# EAGLE design usb_keyboard (EAGLE 7.2.0)
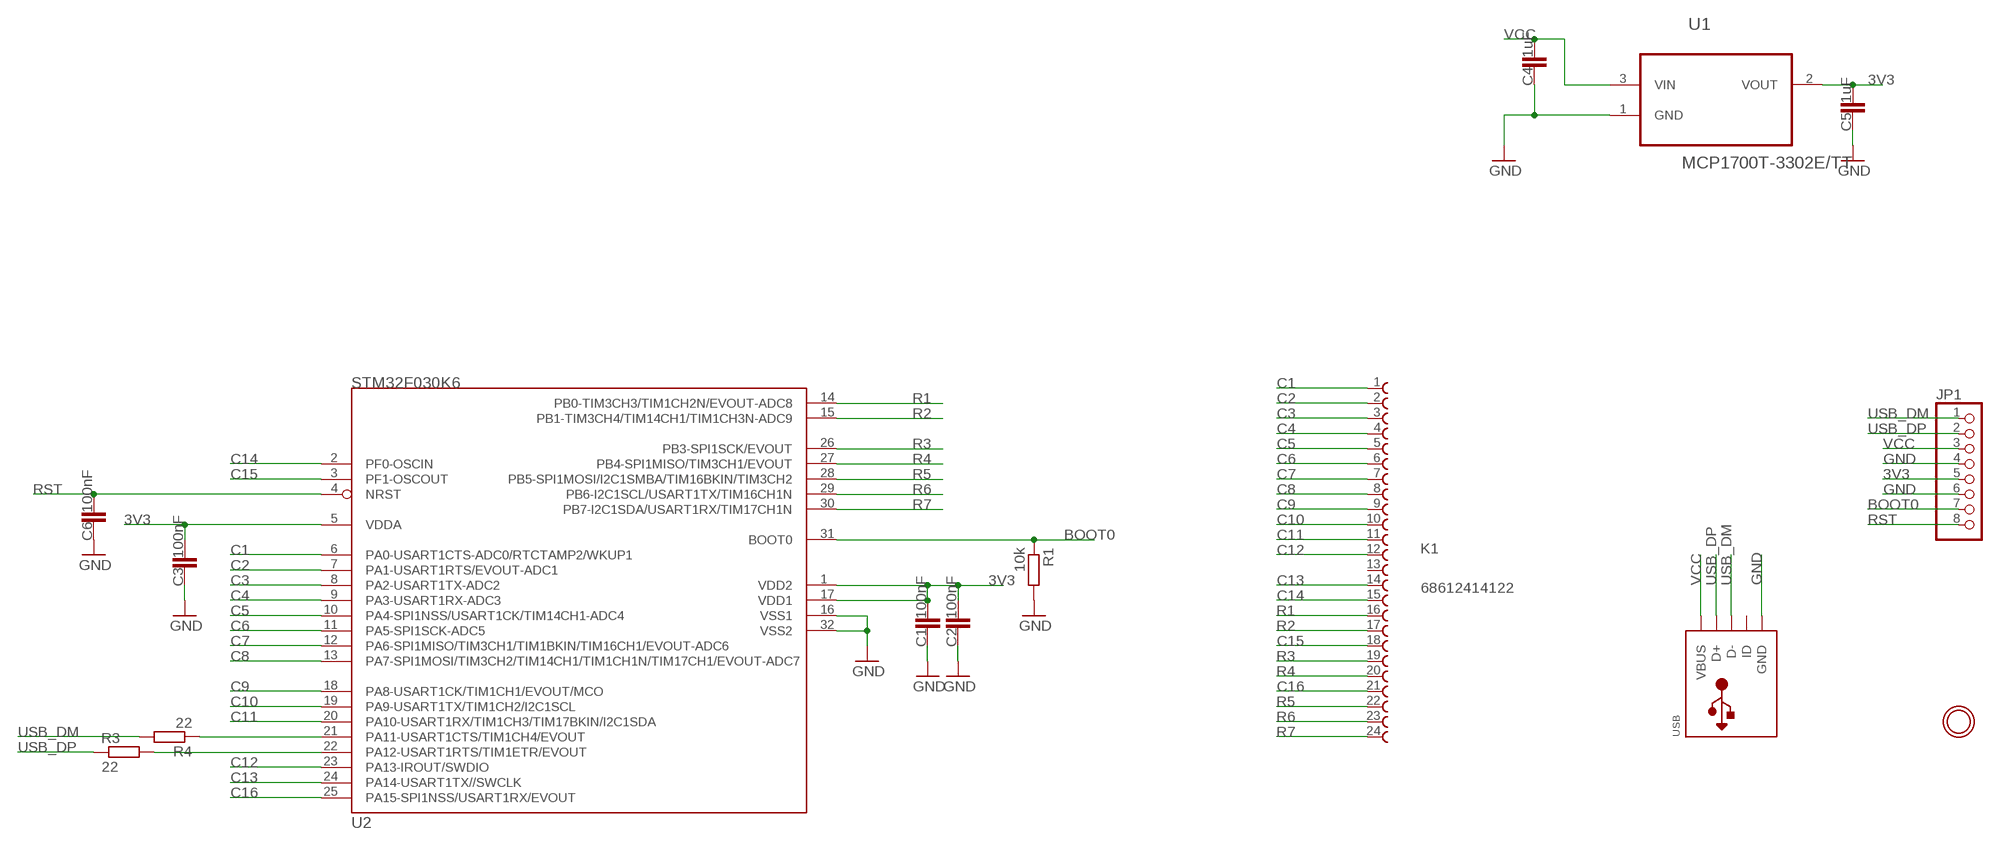
[diagram p0: schematic, sheet 1]

## Parts
C1  100nF  C-EUC0603K  [C0603K]
C2  100nF  C-EUC0603K  [C0603K]
C3  100nF  C-EUC0603K  [C0603K]
C4  1uF  C-EUC0603K  [C0603K]
C5  1uF  C-EUC0603K  [C0603K]
C6  100nF  C-EUC0603K  [C0603K]
JP1  HEADER-1X8ROUND  [1X08_ROUND]
K1  68612414122  [68612414122]
R1  10k  R-EU_R0603  [R0603]
R3  22  R-EU_R0603  [R0603]
R4  22  R-EU_R0603  [R0603]
U1  MCP1700T-3302E/TT  [SOT95P237X112-3N]
U2  STM32F030K6  [LQFP32]
U$2  MOUNTINGHOLE2.0  [MOUNTINGHOLE_2.0_PLATED]
USB  USBMOLEX  [USB-MINIB-THM-MOLEX]

## Nets
3V3: C1.2 C2.2 C3.2 C5.2 JP1.5 U1.2(VOUT) U2.1(VDD2) U2.5(VDDA) U2.17(VDD1)
BOOT0: JP1.7 R1.1 U2.31(BOOT0)
C1: K1.1 U2.6(PA0-USART1CTS-ADC0/RTCTAMP2/WKUP1)
C2: K1.2 U2.7(PA1-USART1RTS/EVOUT-ADC1)
C3: K1.3 U2.8(PA2-USART1TX-ADC2)
C4: K1.4 U2.9(PA3-USART1RX-ADC3)
C5: K1.5 U2.10(PA4-SPI1NSS/USART1CK/TIM14CH1-ADC4)
C6: K1.6 U2.11(PA5-SPI1SCK-ADC5)
C7: K1.7 U2.12(PA6-SPI1MISO/TIM3CH1/TIM1BKIN/TIM16CH1/EVOUT-ADC6)
C8: K1.8 U2.13(PA7-SPI1MOSI/TIM3CH2/TIM14CH1/TIM1CH1N/TIM17CH1/EVOUT-ADC7)
C9: K1.9 U2.18(PA8-USART1CK/TIM1CH1/EVOUT/MCO)
C10: K1.10 U2.19(PA9-USART1TX/TIM1CH2/I2C1SCL)
C11: K1.11 U2.20(PA10-USART1RX/TIM1CH3/TIM17BKIN/I2C1SDA)
C12: K1.12 U2.23(PA13-IROUT/SWDIO)
C13: K1.14 U2.24(PA14-USART1TX//SWCLK)
C14: K1.15 U2.2(PF0-OSCIN)
C15: K1.18 U2.3(PF1-OSCOUT)
C16: K1.21 U2.25(PA15-SPI1NSS/USART1RX/EVOUT)
GND: C1.1 C2.1 C3.1 C4.1 C5.1 C6.1 JP1.4 JP1.6 R1.2 U1.1(GND) U2.16(VSS1) U2.32(VSS2) USB.GND
N$1: R4.1 U2.21(PA11-USART1CTS/TIM1CH4/EVOUT)
N$2: R3.2 U2.22(PA12-USART1RTS/TIM1ETR/EVOUT)
R1: K1.16 U2.14(PB0-TIM3CH3/TIM1CH2N/EVOUT-ADC8)
R2: K1.17 U2.15(PB1-TIM3CH4/TIM14CH1/TIM1CH3N-ADC9)
R3: K1.19 U2.26(PB3-SPI1SCK/EVOUT)
R4: K1.20 U2.27(PB4-SPI1MISO/TIM3CH1/EVOUT)
R5: K1.22 U2.28(PB5-SPI1MOSI/I2C1SMBA/TIM16BKIN/TIM3CH2)
R6: K1.23 U2.29(PB6-I2C1SCL/USART1TX/TIM16CH1N)
R7: K1.24 U2.30(PB7-I2C1SDA/USART1RX/TIM17CH1N)
RST: C6.2 JP1.8 U2.4(NRST)
USB_DM: JP1.1 R4.2 USB.D-
USB_DP: JP1.2 R3.1 USB.D+
VCC: C4.2 JP1.3 U1.3(VIN) USB.VBUS
Unconnected: K1.13 USB.ID

## Library data of the parts
C1-C6 = rcl:C-EU: CAPACITOR, European symbol
JP1 = microbuilder:HEADER-1X8: PIN HEADER
K1 = FPC_Connectors_Flat_Flexible_Cable_rev15c:68612414122: WR-FPC 1.00mm SMT ZIF Horizontal Top Contact, 24 Pins=>Code : Con_FPC_ZIF_1.00_68612414122 <http://katalog.we-online.de/media/images/eican/Con_FPC_ZIF_1.00_6861xx14122_pf2.jpg> Details see: http://katalog.we-online.de/en/em/686_1xx_141_22 Created 2014-07-09, Karrer Zheng 2014 (C) Würth Elektronik
R1 R3 R4 = rcl:R-EU_: RESISTOR, European symbol
U1 = Microchip_By_element14_Batch_1:MCP1700T-3302E/TT: Low Quiescent Current LDO; MPN: MCP1700T-3302E/TT; OC_FARNELL: 1296592; OC_NEWARK: 88H9817; PACKAGE: SOT23-3; SUPPLIER: Microchip
U2 = pel_stm32:STM32F030K6
U$2 = microbuilder:MOUNTINGHOLE: Mounting Hole For #2 screws (0.086"/2.18mm width, 0.094"/2.4mm hole) use 2.5mm
USB = adafruit:USB: USB Connectors USBMINIB - Surface Mount Female Mini-B USB Connector 4UConnector: 06564 By microbuilder.eu Thru-hole RA Female Mini-B USB Connector 4UConnector: 18732 By ladyada.net

## Board
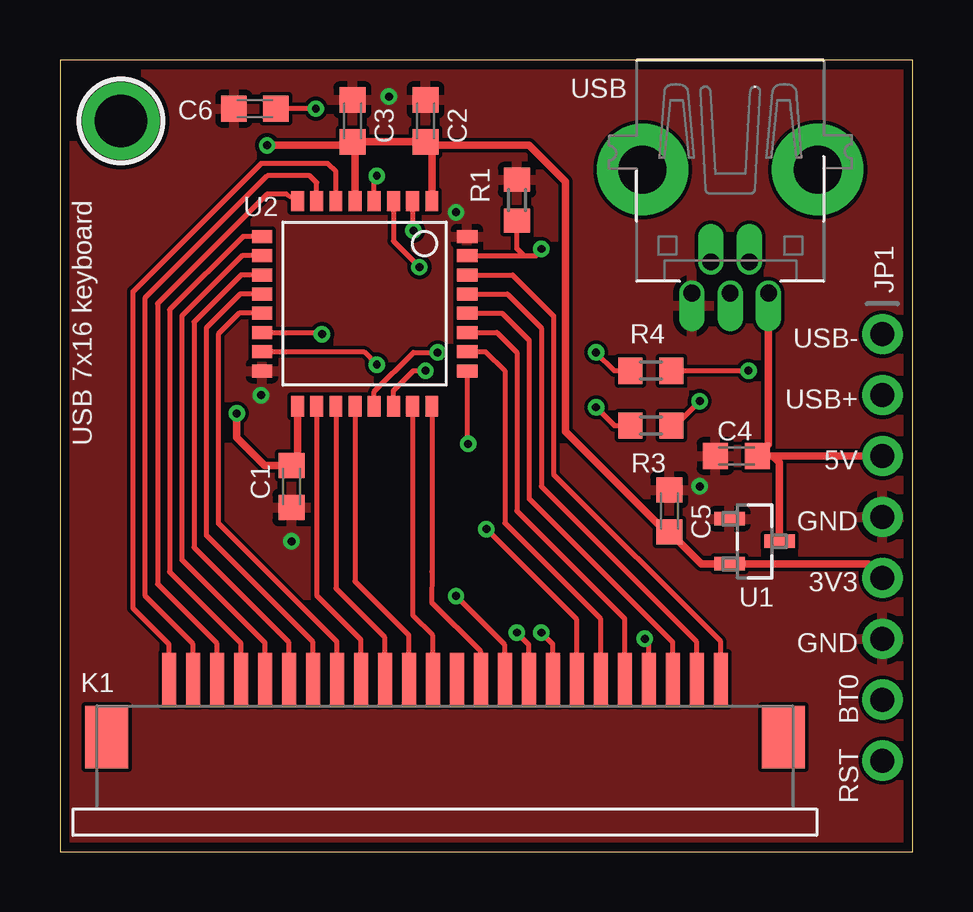
[diagram p1: board, top side]
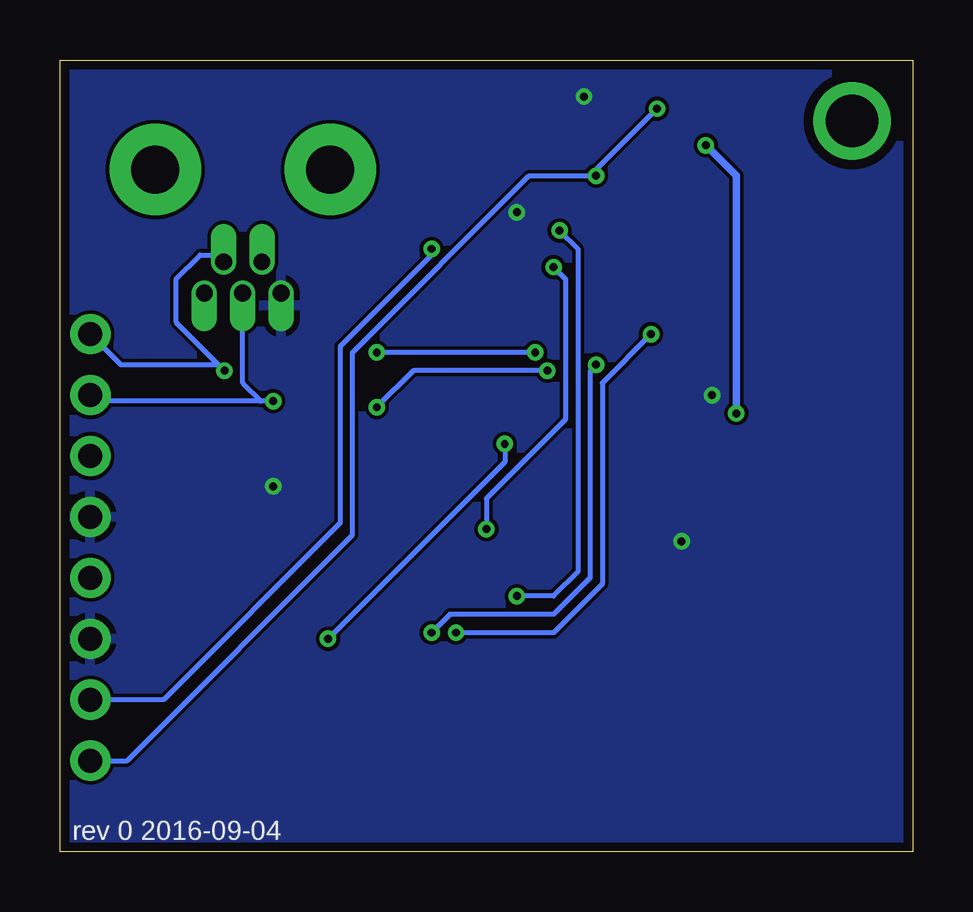
[diagram p2: board, bottom side, seen from below]

Size 35.56 x 33.02 mm. Coordinates in mm from the lower left corner, seen from the top.
Outline: 0,0 35.56,0 35.56,33.02 0,33.02 0,0
Copper layers (1*16): Top 0.0356mm / dielectric 1.5011mm / Bottom 0.0356mm
Design rules "LaenPCBOrder": minimum track width 6mil, minimum drill 13mil, track to track 6mil, track to pad 6mil, pad to pad 6mil, via to via 6mil, smd to smd 6mil, copper to edge 15mil, drill to drill 6mil, minimum pad ring 7mil, minimum via ring 7mil, stop-mask expansion 3mil, vias tented up to drill 0mil, thermal gap 10mil

### Footprints (pad centres in the part's own frame; a part is rotated, then mirrored left to right if it is on the bottom)
C0603K = smd 1.05 x 1.08: 1 -0.875,0; 2 0.875,0
1X08_ROUND = drill 1 pad 1.676: 1 -8.89,0; 2 -6.35,0; 3 -3.81,0; 4 -1.27,0; 5 1.27,0; 6 3.81,0; 7 6.35,0; 8 8.89,0
68612414122 = smd 0.6 x 2.2: 1 -10.69,1.1; 2 -9.69,1.1; 3 -8.69,1.1; 4 -7.69,1.1; 5 -6.69,1.1; 6 -5.69,1.1; 7 -4.69,1.1; 8 -3.69,1.1; 9 -2.69,1.1; 10 -1.69,1.1; 11 -0.69,1.1; 12 0.31,1.1; 13 1.31,1.1; 14 2.31,1.1; 15 3.31,1.1; 16 4.31,1.1; 17 5.31,1.1; 18 6.31,1.1; 19 7.31,1.1; 20 8.31,1.1; 21 9.31,1.1; 22 10.31,1.1; 23 11.31,1.1; 24 12.31,1.1 | smd 1.8 x 2.6: Z1 -13.29,-1.3; Z2 14.91,-1.3
R0603 = smd 1 x 1.1: 1 -0.85,0; 2 0.85,0
SOT95P237X112-3N = smd 0.559 x 1.27: 1 -0.94,-1.041; 2 0.94,-1.041; 3 0,1.041
LQFP32 = smd 0.54 x 0.85: 1 -2.8,-4.275; 2 -2,-4.275; 3 -1.2,-4.275; 4 -0.4,-4.275; 5 0.4,-4.275; 6 1.2,-4.275; 7 2,-4.275; 8 2.8,-4.275; 17 2.8,4.275; 18 2,4.275; 19 1.2,4.275; 20 0.4,4.275; 21 -0.4,4.275; 22 -1.2,4.275; 23 -2,4.275; 24 -2.8,4.275 | smd 0.85 x 0.54: 9 4.275,-2.8; 10 4.275,-2; 11 4.275,-1.2; 12 4.275,-0.4; 13 4.275,0.4; 14 4.275,1.2; 15 4.275,2; 16 4.275,2.8; 25 -4.275,2.8; 26 -4.275,2; 27 -4.275,1.2; 28 -4.275,0.4; 29 -4.275,-0.4; 30 -4.275,-1.2; 31 -4.275,-2; 32 -4.275,-2.8
MOUNTINGHOLE_2.0_PLATED = drill 2.2 pad 3: P$1 0,0
USB-MINIB-THM-MOLEX = drill 0.7 offset: D+ 0,9.72; D- -0.8,8.42; GND 1.6,9.72; ID 0.8,8.42; VBUS -1.6,9.72 | drill 2 pad 3.81: GND1 -3.65,4.57; GND4 3.65,4.57

### Placement (x,y rotation side)
C1  9.65,15.24 90 top
C2  15.24,30.48 270 top
C3  12.19,30.48 270 top
C4  28.19,16.51 0 top
C5  25.4,14.22 270 top
C6  8.13,30.99 0 top
JP1  34.29,12.7 270 top
K1  15.24,6.1 0 top
R1  19.05,27.18 90 top
R3  24.64,17.78 180 top
R4  24.64,20.07 0 top
U1  28.96,12.95 270 top
U2  12.7,22.86 180 top
U$2  2.54,30.48 0 top
USB  27.94,33.02 180 top

### Tracks (layer width: path | path; a pad name or v marks a point on that pad's centre or on a via)
3V3  (via drill 0.33)
  Top 0.305: 9.54,16.26 C1.2 | C1.2 8.52,16.11 7.37,17.27 v7.37,18.29 | v8.64,29.46 12.05,29.46 | U2.5 12.3,29.2 12.05,29.46 | 12.05,29.46 C3.2 C2.2 15.38,29.46 | U2.1 15.5,29.34 15.38,29.46 | U2.17 9.9,16.38 C1.2 | 15.38,29.46 19.56,29.46 21.08,27.94 21.08,17.53 25.26,13.35 C5.2 26.73,12.01 U1.2 33.71,12.01 JP1.5
  Bottom 0.305: v7.37,18.29 7.37,28.19 v8.64,29.46
BOOT0  (via drill 0.33)
  Top 0.203: U2.31 19.34,24.86 | 19.34,24.86 19.05,25.15 R1.1 | 19.34,24.86 19.84,24.86 v20.07,25.15
  Bottom 0.203: v20.07,25.15 20.07,24.89 23.88,21.08 23.88,13.72 31.24,6.35 JP1.7
C1
  Top 0.203: U2.6 11.5,28.38 11.18,28.7 8.38,28.7 3.05,23.37 3.05,10.16 4.55,8.66 K1.1
C2
  Top 0.203: U2.7 10.7,27.91 10.41,28.19 8.64,28.19 3.56,23.11 3.56,10.67 5.55,8.67 K1.2
C3
  Top 0.203: U2.8 9.44,27.43 8.64,27.43 4.06,22.86 4.06,11.18 6.55,8.69 K1.3
C4
  Top 0.203: U2.9 7.63,25.66 4.57,22.61 4.57,11.68 7.55,8.71 K1.4
C5
  Top 0.203: U2.10 7.59,24.86 5.08,22.35 5.08,12.19 8.55,8.72 K1.5
C6
  Top 0.203: U2.11 7.55,24.06 5.59,22.1 5.59,12.7 9.55,8.74 K1.6
C7
  Top 0.203: U2.12 7.51,23.26 6.1,21.84 6.1,13.21 10.55,8.75 K1.7
C8
  Top 0.203: U2.13 7.47,22.46 6.6,21.59 6.6,13.72 11.55,8.77 K1.8
C9
  Top 0.203: U2.18 10.7,10.7 12.55,8.85 K1.9
C10
  Top 0.203: U2.19 11.5,10.99 13.55,8.94 K1.10
C11
  Top 0.203: U2.20 12.3,11.28 14.55,9.03 K1.11
C12
  Top 0.203: U2.23 14.7,9.87 15.55,9.02 K1.12
C13
  Top 0.203: U2.24 15.5,11.69 15.49,10.41 17.55,8.36 K1.14
C14  (via drill 0.33)
  Top 0.203: U2.2 14.7,25.94 v14.73,25.91 | K1.15 18.55,8.63 v16.51,10.67
  Bottom 0.203: v14.73,25.91 13.97,25.15 13.97,11.68 14.99,10.67 v16.51,10.67
C15  (via drill 0.33)
  Top 0.203: U2.3 13.9,25.47 v14.99,24.38 | K1.18 21.55,9.69 v17.78,13.46
  Bottom 0.203: v14.99,24.38 14.48,23.88 14.48,18.03 17.78,14.73 v17.78,13.46
C16  (via drill 0.33)
  Top 0.203: U2.25 16.98,17.06 v17.02,17.02 | K1.21 24.55,8.72 v24.38,8.89
  Bottom 0.203: v17.02,17.02 17.02,16.26 v24.38,8.89
GND  (via drill 0.33)
  other vias: 8.38,19.05 9.65,12.95 16.51,26.67 13.72,31.5 26.67,15.24
  pour Top: -12.7,-12.7 -12.7,50.8 55.88,50.8 55.88,-12.7
  pour Bottom: -5.08,-5.08 -5.08,45.72 48.26,45.72 48.26,-7.62 -5.08,-7.62
N$1  (via drill 0.33)
  Top 0.203: U2.21 13.1,19.2 14.73,20.83 v15.75,20.83 | v22.35,20.83 23.11,20.07 R4.1
  Bottom 0.203: v15.75,20.83 v22.35,20.83
N$2  (via drill 0.33)
  Top 0.203: U2.22 13.9,19.23 14.73,20.07 v15.24,20.07 | v22.35,18.54 23.11,17.78 R3.2
  Bottom 0.203: v15.24,20.07 20.83,20.07 v22.35,18.54
R1  (via drill 0.33)
  Top 0.203: U2.14 10.85,21.66 v10.92,21.59 | K1.16 19.55,8.64 v19.05,9.14
  Bottom 0.203: v10.92,21.59 12.95,19.56 12.95,11.18 14.99,9.14 v19.05,9.14
R2  (via drill 0.33)
  Top 0.203: U2.15 12.67,20.86 v13.21,20.32 | K1.17 20.55,8.66 v20.07,9.14
  Bottom 0.203: v13.21,20.32 13.46,20.07 13.46,11.43 14.99,9.91 19.3,9.91 v20.07,9.14
R3
  Top 0.203: U2.26 17.75,20.86 18.54,20.07 18.54,13.72 22.55,9.71 K1.19
R4
  Top 0.203: U2.27 18.22,21.66 19.05,20.83 19.05,14.22 23.55,9.72 K1.20
R5
  Top 0.203: U2.28 18.43,22.46 19.56,21.34 19.56,14.73 25.55,8.74 K1.22
R6
  Top 0.203: U2.29 18.65,23.26 20.07,21.84 20.07,15.24 26.55,8.76 K1.23
R7
  Top 0.203: U2.30 18.87,24.06 20.57,22.35 20.57,15.75 27.55,8.77 K1.24
RST  (via drill 0.33)
  Top 0.203: U2.4 13.1,28.09 v13.21,28.19 | v10.67,30.99 C6.2
  Bottom 0.203: v10.67,30.99 13.21,28.45 v13.21,28.19 16,28.19 23.37,20.83 23.37,13.21 32.77,3.81 JP1.8
USB_DM  (via drill 0.33)
  Top 0.203: R4.2 v28.7,20.07
  Bottom 0.203: JP1.1 33.02,20.32 28.96,20.32 | 28.96,20.32 v28.7,20.07 | USB.D- 28.78,24.89 29.72,24.89 30.73,23.88 30.73,22.1 28.96,20.32
USB_DP  (via drill 0.33)
  Top 0.203: R3.1 25.91,18.03 v26.67,18.8
  Bottom 0.203: USB.D+ 27.94,19.56 27.18,18.8 | v26.67,18.8 27.18,18.8 | 27.18,18.8 34.04,18.8 JP1.2
VCC
  Top 0.305: USB.VBUS 29.54,16.98 C4.2 29.72,16.51 | JP1.3 29.72,16.51 | U1.3 30,16.23 29.72,16.51

### Text on the board
tPlace: USB 7x16 keyboard | USB- | USB+ | 5V | GND | 3V3 | GND | BT0 | RST
bPlace: rev 0 2016-09-04